# Altium schematic sheet lowVoltage.SchDoc
size A4
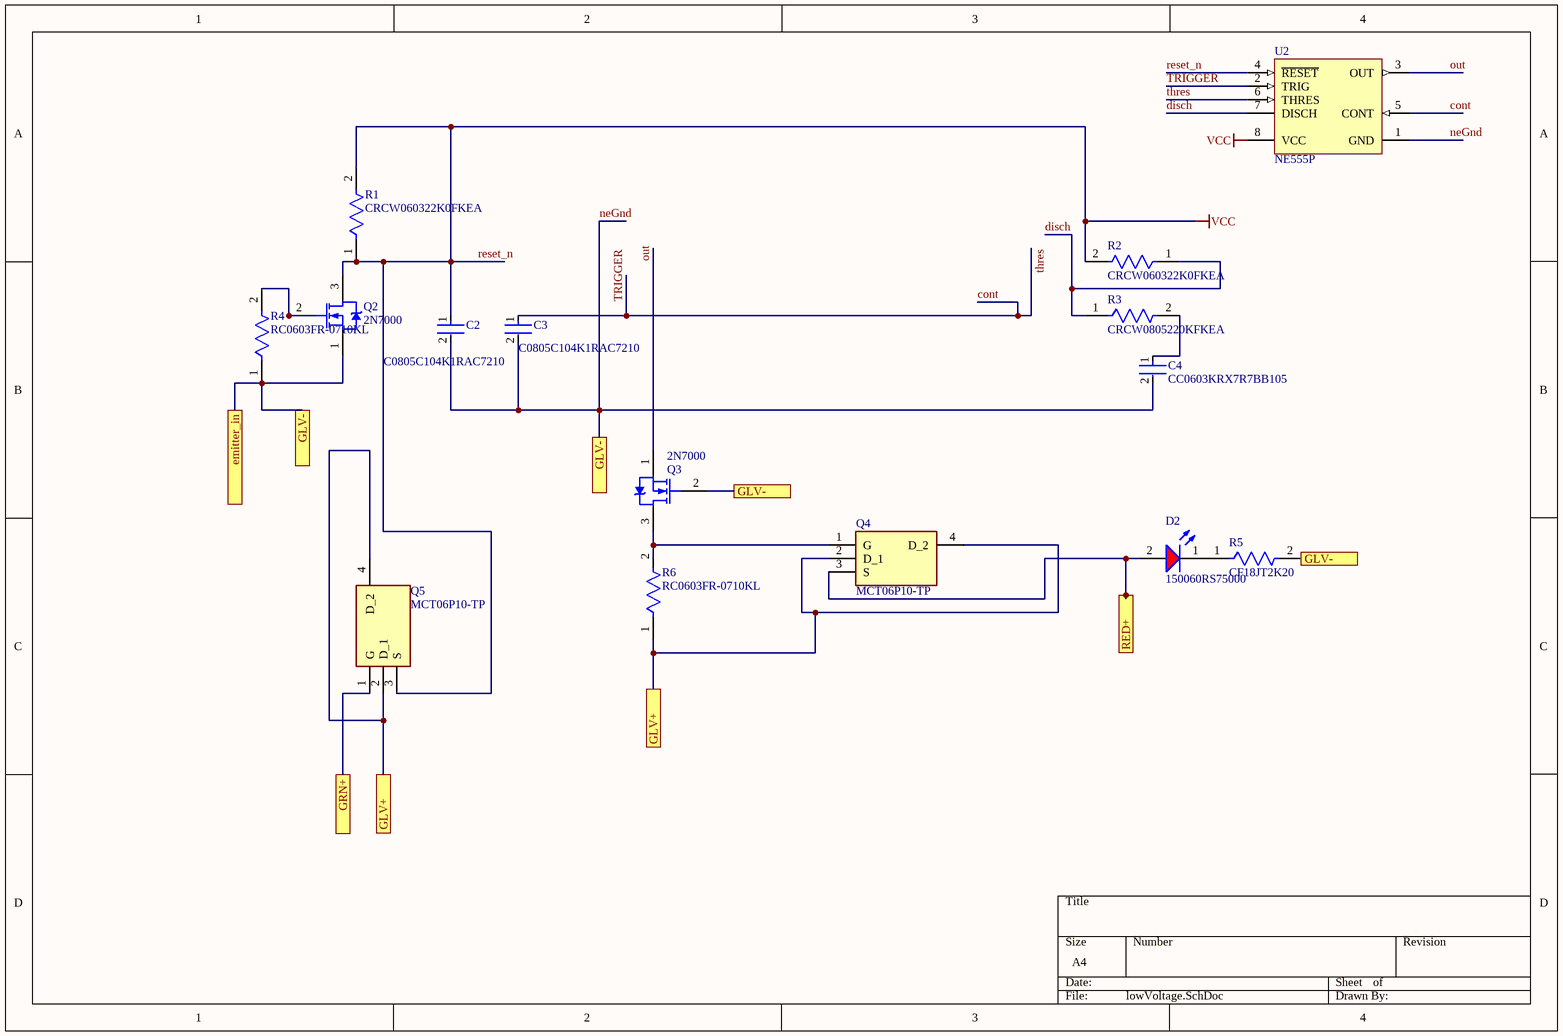
[diagram p0: lowVoltage.SchDoc]

## Parts
C2  C0805C104K1RAC7210  [FP-C0805C-DN-MFG]
C3  C0805C104K1RAC7210  [FP-C0805C-DN-MFG]
C4  CC0603KRX7R7BB105  [FP-CC0603-DA-MFG]
D2  150060RS75000  [WL-SMCW_0603_150060xx75000]
Q2  2N7000  [ONSC-TO-92-3-29-11]
Q3  2N7000  [ONSC-TO-92-3-29-11]
Q4  MCT06P10-TP  [SOT230P700X180-4N]
Q5  MCT06P10-TP  [SOT230P700X180-4N]
R1  CRCW060322K0FKEA  [FP-CRCW0603-e3-IPC_B]
R2  CRCW060322K0FKEA  [FP-CRCW0603-e3-IPC_B]
R3  CRCW0805220KFKEA  [FP-CRCW0805-e3-IPC_C]
R4  RC0603FR-0710KL  [FP-RC0603-0_55-IPC_C]
R5  CF18JT2K20  [FP-CF18-MFG]
R6  RC0603FR-0710KL  [FP-RC0603-0_55-IPC_C]
U2  NE555P  [P0008A]

## Ports
emitter_in, GLV+, GLV-, GRN+, RED+

## Nets
reset_n: C2.1 Q2.3(D) Q5.3(S) R1.1 R1.2 R2.2 U2.4(~{RESET}) U2.8(VCC)  [also labelled VCC]
cont: C3.1 U2.2(TRIG) U2.5(CONT) U2.6(THRES)  [also labelled thres, TRIGGER]
disch: R2.1 R3.1 U2.7(DISCH)
GLV+: Q4.2(D_1) Q4.4(D_2) Q5.2(D_1) Q5.4(D_2) R6.1 ; port GLV+
GRN+: Q5.1(G) ; port GRN+
neGnd: C2.2 C3.2 C4.2 Q2.1(S) Q3.2(G) R4.1 R5.2 U2.1(GND) ; port GLV-, port emitter_in
out: Q3.1(S) U2.3(OUT)
RED+: D2.2(A) Q4.3(S) ; port RED+
NetC4_1: C4.1 R3.2
NetD2_1: D2.1(K) R5.1
NetQ2_2: Q2.2(G) R4.2
NetQ3_3: Q3.3(D) Q4.1(G) R6.2

## Library data of the parts
C2 C3 = CMP-03020-008988-2: C0805 0.10 μF X7R 30ppm/°C 10.00% 100 V; Manufacturer: KEMET; Tolerance: 0.1; Value: 0.10 μF; Material: Ceramic; Voltage Rating: 100 V; Capacitance: 0.10 μF; RoHS: TRUE; Manufacturer Part Number: C0805C104K1RAC7210; ComponentLink2Description: Datasheet; Automotive: No; Device Class L3: Ceramic Capacitors; Category: Cap; Octopart: https://octopart.com/c0805c104k1rac7210-kemet-24791099; Temperature Range Low: -55°C; Lead Free: Yes; Device Class L2: Capacitors; ComponentLink2URL: https://content.kemet.com/datasheets/KEM_C1003_C0G_SMD.pdf; Temperature: -55°C to +125°C; Package: C0805C-DN; Temperature Range High: +125°C; Temperature Coefficient: 30ppm/°C; Ipc Land Pattern Name: CAPC200125X78; Height: 0.88mm; Device Class L1: Passive Components; Temperature Characteristic: X7R
C4 = CMP-03422-000924-1: CAP CER 1UF 16V X7R 0603; Manufacturer: YAGEO; Tolerance: 0.1; Description: CC0603 1 uF X7R 10.00% 16 V; Temperature Coefficient: 15%; Material: Ceramic; Package: CC0603-DA; RoHS: TRUE; Device Class L2: Capacitors; Temperature Characteristic: X7R; Temperature: -55°C to +125°C; Temperature Range Low: -55°C; Automotive: No; ComponentLink2Description: Datasheet; Value: 1 uF; Lead Free: Yes; Capacitance: 1 uF; ComponentLink2URL: http://www.yageo.com/documents/recent/UPY-GPHC_X7R_6.3V-to-50V_18.pdf; Device Class L1: Passive Components; Voltage: 16 V; Octopart: https://octopart.com/cc0603krx7r7bb105-yageo-42271928; Category: Cap; Digikey Description: CAP CER 1UF 16V X7R 0603; Footprint Url: http://www.yageo.com/exep/pages/download/literatures/UPY-C_GEN_24.pdf; Height: 0.9mm; Manufacturer Part Number: CC0603KRX7R7BB105; Voltage Rating: 16 V; Temperature Range High: +125°C; Mouser Description: Multilayer Ceramic Capacitor, CC Series, 1 - F, - 10%, X7R, 16 V, 0603 [1608 Metric]; Device Class L3: Ceramic Capacitors
D2 = CMP-1426-00001-3: NexarPartId: 29717776; Color: Red; Power Dissipation: 72mW; Max Reverse Voltage (DC): 5V; Peak Wavelength: 630nm; Viewing Angle: 140°; Forward Voltage: 2V; Luminous Intensity: 250mcd; Forward Current: 100mA; Dominant Wavelength: 625nm; Lens Style: Clear, Rectangular; Max Junction Temperature (Tj): 95°C; Test Current: 20mA; Mount: Surface Mount; Packaging: Tape and Reel; Case Code (Metric): 1608; Max Operating Temperature: 85°C; Case Code (Imperial): 0603; REACH SVHC: Unknown; Width: 800µm; Length: 1.6mm; Reverse Voltage: 5V; Height: 700µm; Case/Package: 0603; RoHS: Compliant; Wavelength: 625nm; Min Operating Temperature: -40°C
Q2 Q3 = CMP-1058-00936-1: Small Signal MOSFET, 200 mA, 60 V, N-Channel, 3-Pin TO-92, Bulk Box; Manufacturer: On Semiconductor; Ciss Typ (pF): 60; VGS(th) Max (V): 3; Crss Typ (pF): 5; Channel Polarity: N Channel; VGS Max (V): 20; Configuration: Single; PD Max (W): 0.35; Coss Typ (pF): 25; ID Max (A): 0.2; PackageVersion: Rev. AM; ComponentLink3URL: http://www.onsemi.cn/pub_link/Collateral/2N6426-D.PDF; ComponentLink2URL: http://www.onsemi.com/pub_link/Collateral/2N7000-D.PDF; DatasheetVersion: Rev. 8; Mounting Technology: Through Hole; V(BR)DSS Min (V): 60; PartNumber: 2N7000; PackageDescription: 3-Pin Transistor Outline, Body 4.825 x 3.685 mm, Pitch 1.27 mm; ComponentLink2Description: Datasheet; ComponentLink1URL: http://www.onsemi.com/; PackageReference: TO-92-3-29-11_AM_SL; Packing: Bulk Box; ComponentLink1Description: Manufacturer URL; Package Type: TO-92; ComponentLink3Description: Package Specification
Q4 Q5 = MCT06P10-TP: P-CHANNEL MOSFET; Manufacturer_Name: MCC; Geometry.Height: 1.8mm; Manufacturer_Part_Number: MCT06P10-TP; Mouser Part Number: 833-MCT06P10-TP; Mouser Price/Stock: https://www.mouser.co.uk/ProductDetail/Micro-Commercial-Components-MCC/MCT06P10-TP?qs=u16ybLDytRb58JP1wVwnug%3D%3D; Arrow Part Number: MCT06P10-TP; Arrow Price/Stock: https://www.arrow.com/en/products/mct06p10-tp/micro-commercial-components; Datasheet Link: https://www.mccsemi.com/pdf/Products/MCT06P10(SOT-223).pdf
R1 R2 = CMP-2000-03092-2: RES Thick Film, 22kΩ, 1%, 0.1W, 100ppm/°C, 0603; Voltage Rating: 75V; Max Power Dissipation: 100mW; Resistance: 22kR; Radiation Hardening: No; Termination: SMD/SMT; Composition: Thick Film; Tolerance: 1%; Temperature Coefficient: 100ppm/°C; Case Code (Imperial): 0603; Height: 0.45mm; Packaging: Tape and Reel; Power Rating: 100mW; Case/Package: 0603; Number of Terminations: 2; Package Quantity: 10; Weight: 7.1E-05oz; Voltage Rating (DC): 75V; Max Operating Temperature: 155°C; Contact Plating: Tin; Width: 0.85mm; Case Code (Metric): 1608; Mount: Surface Mount; Min Operating Temperature: -55°C; Depth: 0.85mm; Features: Automotive AEC-Q200; Military Standard: Not; Lead Free: Lead Free; Length: 1.55mm
R3 = CMP-1013-00772-3: RES Thick Film, 220kΩ, 1%, 0.125W, 100ppm/°C, 0805; Max Power Dissipation: 125mW; Resistance: 220kR; Voltage Rating: 150V; Max Operating Temperature: 155°C; Min Operating Temperature: -55°C; Termination: SMD/SMT; Temperature Coefficient: 100ppm/°C; Radiation Hardening: No; Number of Terminations: 2; Length: 2mm; Weight: 0.000194oz; Packaging: Tape and Reel; Case Code (Imperial): 0805; Case/Package: 0805; Military Standard: Not; Package Quantity: 10; Contact Plating: Tin; Power Rating: 125mW; Tolerance: 1%; Lead Free: Lead Free; Height: 0.45mm; Width: 1.25mm; Composition: Thick Film; Voltage Rating (DC): 150V; Features: Automotive AEC-Q200; Case Code (Metric): 2012; Depth: 1.25mm
R4 R6 = CMP-2100-03664-2: RES 10K OHM 1% 1/10W 0603; Voltage Rating: 75V; Voltage Rating (DC): 50V; Resistance: 10kR; Power Rating: 100mW; Temperature Coefficient: 100ppm/°C; Depth: 0.8mm; Termination: SMD/SMT; Resistor Type: Thick Film; Series: RC; Construction: Rectangular; Features: Moisture Resistant; Packaging: Tape and Reel; Min Operating Temperature: -55°C; Number of Terminations: 2; Lead Pitch: 0.3mm; RoHS Compliant: Yes; Case/Package: 0603; Resistance Tolerance: 1%; Military Standard: Not; Weight: 7.1E-05oz; Number of Pins: 2; Tolerance: 1%; Length: 1.6mm; Case Code (Imperial): 0603; Lead Free: Lead Free; Width: 0.8mm; Max Power Dissipation: 100mW; Height: 0.45mm; Max Operating Temperature: 155°C; Case Code (Metric): 1608; Size Code: 0603
R5 = CMP-26528-000001-1: RES 2.2K OHM 1/8W 5% CF AXIAL; Manufacturer: Stackpole Electronics Inc; Value: 2.2kΩ; Voltage Rating: 250V; Temperature Coefficient: 0/-400ppm/°C; Power Rating: 0.125W; Composition: Carbon Film; Octopart: https://octopart.com/cf18jt2k20-stackpole+electronics-19205714; Tolerance: 5%; Series: CF; Temperature Range Low: -55°C; ComponentLink2URL: https://www.seielect.com/catalog/sei-cf_cfm.pdf; Ipc Land Pattern Name: RESAD656W65L360D200; Package: CF18; Device Class L2: Resistors; Device Class L3: Through-Hole Resistors; Resistance: 2.2kΩ; Height: 2mm; Category: Res; ComponentLink2Description: Datasheet; Manufacturer Part Number: CF18JT2K20; Lead Free: Yes; Temperature Range High: +155°C; Temperature: -55°C to +155°C; RoHS: TRUE; Device Class L1: Passive Components; Digikey Description: RES 2.2K OHM 1/8W 5% CF AXIAL; Automotive: No
U2 = CMP-2000-04954-1: Precision Timer, 4.5 to 16 V, 0 to 70 degC, 8-Pin DIP, Pb-Free, Tube; Manufacturer: TexasInstruments; Maximum High Level Output Current: -200mA; Number of Internal Timers: 1; Operating Supply Voltage: 5; Maximum Low Level Output Current: 200mA; Rad Hard: No; Packaging: Rail/Tube; Manufacturer URL: http://www.ti.com/; Package Reference: P8; Package Description: 8-Pin Double In-line Package, Body 9.59 x 6.35 mm, Pitch 2.54 mm; Package URL: http://www.ti.com/lit/ml/mpdi001b/mpdi001b.pdf; Type: Standard; Datasheet URL: http://www.ti.com/general/docs/lit/getliterature.tsp?genericPartNumber=NE555&fileType=pdf; Category: Timer; Package: 8PDIP; Datasheet Version: Rev. I, 09/2014